# Altium schematic sheet ArduinoUnoShield.SchDoc
size A4
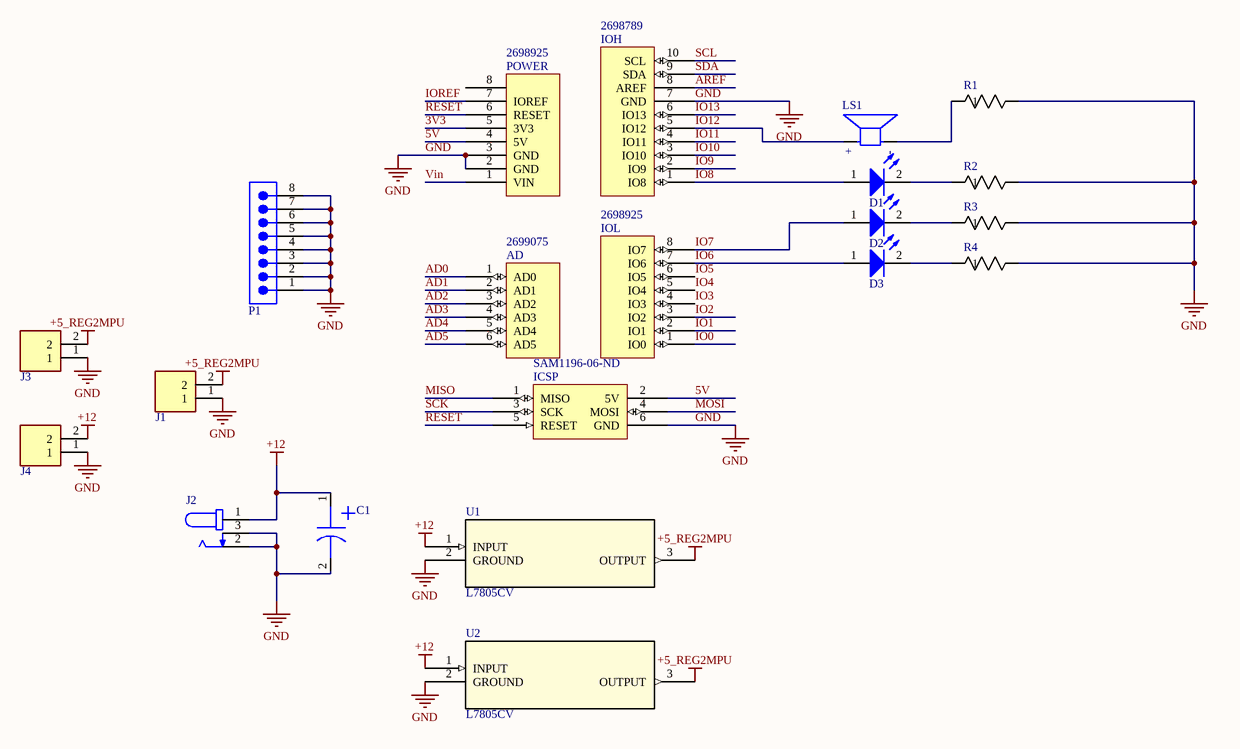
[diagram p0: ArduinoUnoShield.SchDoc]

## Parts
AD  Supplier Part Number 4: 2699075  [Header 6x1 8.5mm]  (hidden comment: AD)
C1  ESK475M035AC3AA  [CAP THT ELECTROLYTIC]  (value not drawn)
D1  Blue, 3.2V, 40°  [LED THROUGH HOLE]  (value not drawn)
D2  Blue, 3.2V, 40°  [LED THROUGH HOLE]  (value not drawn)
D3  Blue, 3.2V, 40°  [LED THROUGH HOLE]  (value not drawn)
ICSP  Supplier Part Number 5: SAM1196-06-ND  [ICSP]  (hidden comment: ICSP)
IOH  Supplier Part Number 3: 2698789  [Header 10x1 8.5mm]  (hidden comment: IOH)
IOL  Supplier Part Number 4: 2698925  [Header 8x1 8.5mm]  (hidden comment: IOL)
J1  282836-2  [TE_282836-2]  (value not drawn)
J2  DCJ200-10-A-XX-K_REVA  [DC POWER JACK]  (value not drawn)
J3  282836-2  [TE_282836-2]  (value not drawn)
J4  282836-2  [TE_282836-2]  (value not drawn)
LS1  AT-1224-TWT-5V-2-R  [BUZZER]  (value not drawn)
P1  61300811121  [8 PIN HEADER]  (value not drawn)
POWER  Supplier Part Number 4: 2698925  [Header 8x1 8.5mm]  (hidden comment: POWER_UNO)
R1  RNMF14FTC200R  [RESISTOR THROUGH HOLE]  (value not drawn)
R2  RNMF14FTC200R  [RESISTOR THROUGH HOLE]  (value not drawn)
R3  RNMF14FTC200R  [RESISTOR THROUGH HOLE]  (value not drawn)
R4  RNMF14FTC200R  [RESISTOR THROUGH HOLE]  (value not drawn)
U1  L7805CV  [7805 REG]
U2  L7805CV  [7805 REG]

## Nets
+5_REG2MPU: J1.2 J3.2 U1.3(OUTPUT) U2.3(OUTPUT)
+12: C1.1 J2.1 J4.2 U1.1(INPUT) U2.1(INPUT)
GND: C1.2 ICSP.6(GND) IOH.7(GND) J1.1 J2.2 J2.3 J3.1 J4.1 P1.1 P1.2 P1.3 P1.4 P1.5 P1.6 P1.7 P1.8 POWER.2(GND) POWER.3(GND) R1.2 R2.2 R3.2 R4.2 U1.2(GROUND) U2.2(GROUND)
3V3: POWER.5(3V3)
5V: ICSP.2(5V) POWER.4(5V)
AD0: AD.1(AD0)
AD1: AD.2(AD1)
AD2: AD.3(AD2)
AD3: AD.4(AD3)
AD4: AD.5(AD4)
AD5: AD.6(AD5)
AREF: IOH.8(AREF)
IO0: IOL.1(IO0)
IO1: IOL.2(IO1)
IO2: IOL.3(IO2)
IO3: IOL.4(IO3)
IO4: IOL.5(IO4)
IO5: IOL.6(IO5)
IO6: D3.1(A) IOL.7(IO6)
IO7: D2.1(A) IOL.8(IO7)
IO8: D1.1(A) IOH.1(IO8)
IO9: IOH.2(IO9)
IO10: IOH.3(IO10)
IO11: IOH.4(IO11)
IO12: IOH.5(IO12) LS1.P
IO13: IOH.6(IO13)
IOREF: POWER.7(IOREF)
MISO: ICSP.1(MISO)
MOSI: ICSP.4(MOSI)
RESET: ICSP.5(RESET) POWER.6(RESET)
SCK: ICSP.3(SCK)
SCL: IOH.10(SCL)
SDA: IOH.9(SDA)
Vin: POWER.1(VIN)
NetD1_2: D1.2(K) R2.1
NetD2_2: D2.2(K) R3.1
NetD3_2: D3.2(K) R4.1
NetLS1_N: LS1.N R1.1

Not connected (* = marked no-connect by the designer): POWER 8

## Notes on the sheet
- (in symbol AT-1224-TWT-5V-2-R) +; -

## Library data of the parts
C1 = ESK475M035AC3AA: CAP ALUM 4.7UF 20% 35V RADIAL TH; Value: 4.7 µF 35 V Aluminum Electrolytic Capacitors Radial, Can 2000 Hrs @ 85°C; PIN: ESK475M035AC3AA; Digikey link: https://www.digikey.com/en/products/detail/kemet/ESK475M035AC3AA/13176259
D1-D3 = 151051BS04000: WL-TMRC Mono-color Round Color, THT, D5.9 x H8.7mm, Blue, 3.2V, 40°; Manufacturer: Wurth Elektronik; Case/Size Code: 5mm; Chip Technology: GaN; Dominant Wavelength: 470nm; Luminous Intensity: 500mcd; Peak Wavelength: 465nm; Value: LED GREEN DIFFUSED 3MM ROUND T/H; Manufacturer Part Number: 151051BS04000; Category: Signal LEDs; Match Code: WL-TMRC; ComponentLink1Description: Website Link; ComponentLink1URL: https://www.we-online.com/redexpert/article/151051BS04000?ad; ComponentLink2Description: Datasheet Link; ComponentLink2URL: https://www.we-online.com/redexpert/spec/151051BS04000?ad; Mount: Through Hole; Operating Temperature Max: 85°C; Operating Temperature Min: -40°C; Packaging: Bulk; Height: 8.7mm; Diameter: 5.9mm; Emitting Color: Blue; Forward Voltage: 3.2V; Viewing Angle: 40°; PIN: 151031VS06000; Digikey link: https://www.digikey.com/en/products/detail/w%C3%BCrth-elektronik/151031VS06000/4489988
J1 J3 J4 = 282836-2: Terminal Block Connector Wire Receptacle 2 5 mm 30-16 AWG Green 13.5 A 300 V | TE Connectivity 282836-2; SnapEDA_Link: https://www.snapeda.com/parts/282836-2/TE+Connectivity+AMP+Connectors/view-part/?ref=snap; Package: None; Value: *; MF: TE Connectivity; MP: 282836-2; Check_prices: https://www.snapeda.com/parts/282836-2/TE+Connectivity+AMP+Connectors/view-part/?ref=eda; PIN: 282836-2; Digikey link: https://www.digikey.com/en/products/detail/te-connectivity-amp-connectors/282836-2/1826939
J2 = DCJ200-10-A-XX-K_REVA: Power Barrel Connector Jack 2.05mm ID (0.081), 5.50mm OD (0.217) Through Hole, Right Angle; MF: Global Connector Technology; MP: DCJ200-10-A-K1-K; SnapEDA_Link: https://www.snapeda.com/parts/DCJ200-10-A-K1-K/Global+Connector+Technology/view-part/?ref=snap; Package: None; Value: *; Check_prices: https://www.snapeda.com/parts/DCJ200-10-A-K1-K/Global+Connector+Technology/view-part/?ref=eda
LS1 = AT-1224-TWT-5V-2-R: Buzzers Transducer, Externally Driven Magnetic 5 V 50mA 2.4kHz 87dB @ 5V, 10cm Through Hole PC Pins; Value: BUZZER MAGNETIC 5V 12MM TH; Package: None; Price: None; MP: AT-1224-TWT-5V-2-R; Availability: Unavailable; PIN: WT-1205; Digikey link: https://www.digikey.com/en/products/detail/soberton-inc/WT-1205/479674
P1 = 61300811121: WR-PHD Pin Header, THT, Vertical, pitch 2.54mm, 1 Row, 8P; Manufacturer: Wurth Elektronik; Contact Resistance: 20mOhm; Rated Current: 3A; Working Voltage: 250V; Withstanding Voltage: 500V; Manufacturer Part Number: 61300811121; Category: Board-to-Board Connectors; Match Code: WR-PHD; ComponentLink1Description: Website Link; ComponentLink1URL: https://www.we-online.com/redexpert/article/61300811121?ad; ComponentLink2Description: Datasheet Link; ComponentLink2URL: https://www.we-online.com/redexpert/spec/61300811121?ad; Mount: Through Hole; Operating Temperature Max: 105°C; Operating Temperature Min: -40°C; Packaging: Bag; Gender: Pin Header; Number of Pins: 8; Number of Rows: 1; Orientation: Vertical; Pitch: 2.54mm
R1-R4 = RNMF14FTC200R: 200 Ohms ±1% 0.25W, 1/4W Through Hole Resistor Axial Flame Retardant Coating, Safety Metal Film; Mfr_Name: Stackpole International; Value: RES 200 OHM 1% 1/4W AXIAL; PIN: RNMF14FTC200R; Digikey link: https://www.digikey.com/en/products/detail/stackpole-electronics-inc/RNMF14FTC200R/2617310
U1 U2 = L7805CV: Linear Voltage Regulator IC Positive Fixed 1 Output 1.5A TO-220; Mfr_Name: STMicroelectronics; Value: IC REG LINEAR 5V 1.5A TO220AB; RefDes: RefDes; Type: Type; PIN: L7805CV; Digiky link: https://www.digikey.com/en/products/detail/stmicroelectronics/L7805CV/585964
AD = AD: Supplier 1: Arrow; Supplier Part Number 1: 2699089; Supplier 2: Digi-Key; Supplier Part Number 2: SAM1198-06-ND; Supplier 3: Arrow; Supplier Part Number 3: 2699088; Supplier 4: Arrow
ICSP = ICSP: Supplier 1: Arrow; Supplier Part Number 1: 2699117; Supplier 2: Arrow; Supplier Part Number 2: 2699116; Supplier 3: Digi-Key; Supplier Part Number 3: SAM1185-06-ND; Supplier 4: Arrow; Supplier Part Number 4: 2699091; Supplier 5: Digi-Key
IOH = IOH: Supplier 1: Arrow; Supplier Part Number 1: 2698803S4475693N1004; Supplier 2: Digi-Key; Supplier Part Number 2: SAM1198-10-ND; Supplier 3: Arrow
IOL = IOL: Supplier 1: Digi-Key; Supplier Part Number 1: SAM1198-08-ND; Supplier 2: Arrow; Supplier Part Number 2: 2698939; Supplier 3: Arrow; Supplier Part Number 3: 2698940; Supplier 4: Arrow
POWER = POWER_UNO: Supplier 1: Digi-Key; Supplier Part Number 1: SAM1198-08-ND; Supplier 2: Arrow; Supplier Part Number 2: 2698939; Supplier 3: Arrow; Supplier Part Number 3: 2698940; Supplier 4: Arrow